# Altium schematic sheet Bottom+Board_V1.schdoc
size 185 x 116 mm
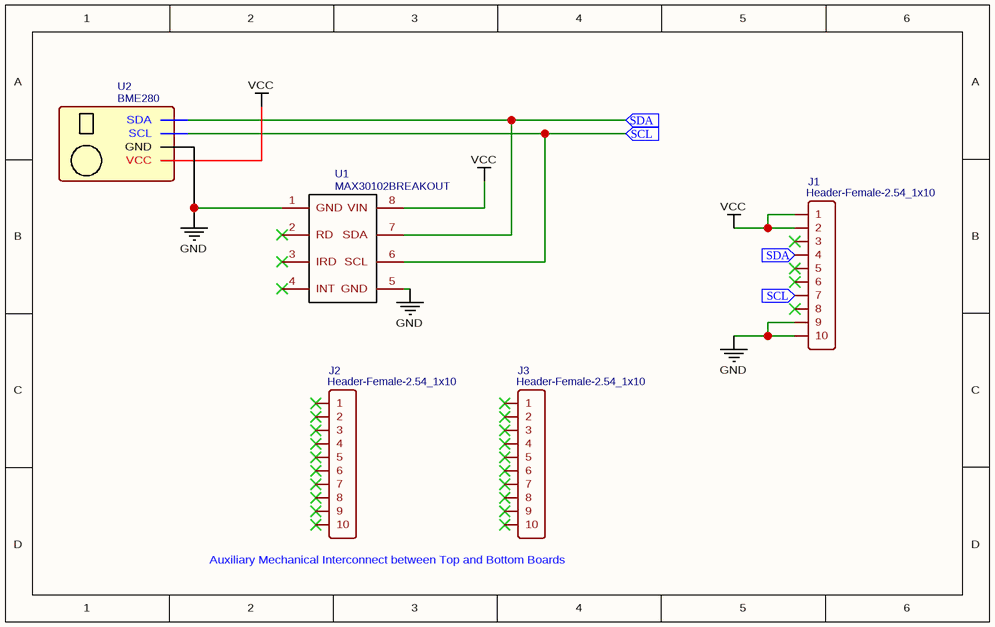
[diagram p0: Bottom+Board_V1.schdoc]

## Parts
J1  Header-Female-2.54_1x10  [HDR-TH_10PIN-V-FEMALE-PITCH2.54]
J2  Header-Female-2.54_1x10  [HDR-TH_10PIN-V-FEMALE-PITCH2.54]
J3  Header-Female-2.54_1x10  [HDR-TH_10PIN-V-FEMALE-PITCH2.54]
U1  MAX30102BREAKOUT  [MAX30102PCB COPY]
U2  BME280  [BME280]

## Ports
SCL, SDA

## Nets
GND: J1.9 J1.10 U1.1(GND) U1.5(GND) U2.2(GND)
VCC: J1.1 J1.2 U1.8(VIN) U2.1(VCC)
SCL: J1.7 U1.6(SCL) U2.3(SCL) ; port SCL
SDA: J1.4 U1.7(SDA) U2.4(SDA) ; port SDA

Not connected (* = marked no-connect by the designer): J1 3* 5* 6* 8*; J2 1* 2* 3* 4* 5* 6* 7* 8* 9* 10*; J3 1* 2* 3* 4* 5* 6* 7* 8* 9* 10*; U1 2(RD)* 3(IRD)* 4(INT)*

## Notes on the sheet
- Auxiliary Mechanical Interconnect between Top and Bottom Boards

## Library data of the parts
J1-J3 = Header-Female-2.54_1x10: BOM_Manufacturer: BOOMELE; BOM_Manufacturer Part: 2.54mm 1*10P Straight Female header Gold-plated; BOM_Supplier: LCSC; BOM_Supplier Part: C35445; spicePre: J
U1 = MAX30102BREAKOUT: Contributor: nickklein95; BOM_Manufacturer Part: MAX30102; spicePre: U
U2 = BME280: Contributor: Даниил Баюков (sleepsemek); spicePre: S